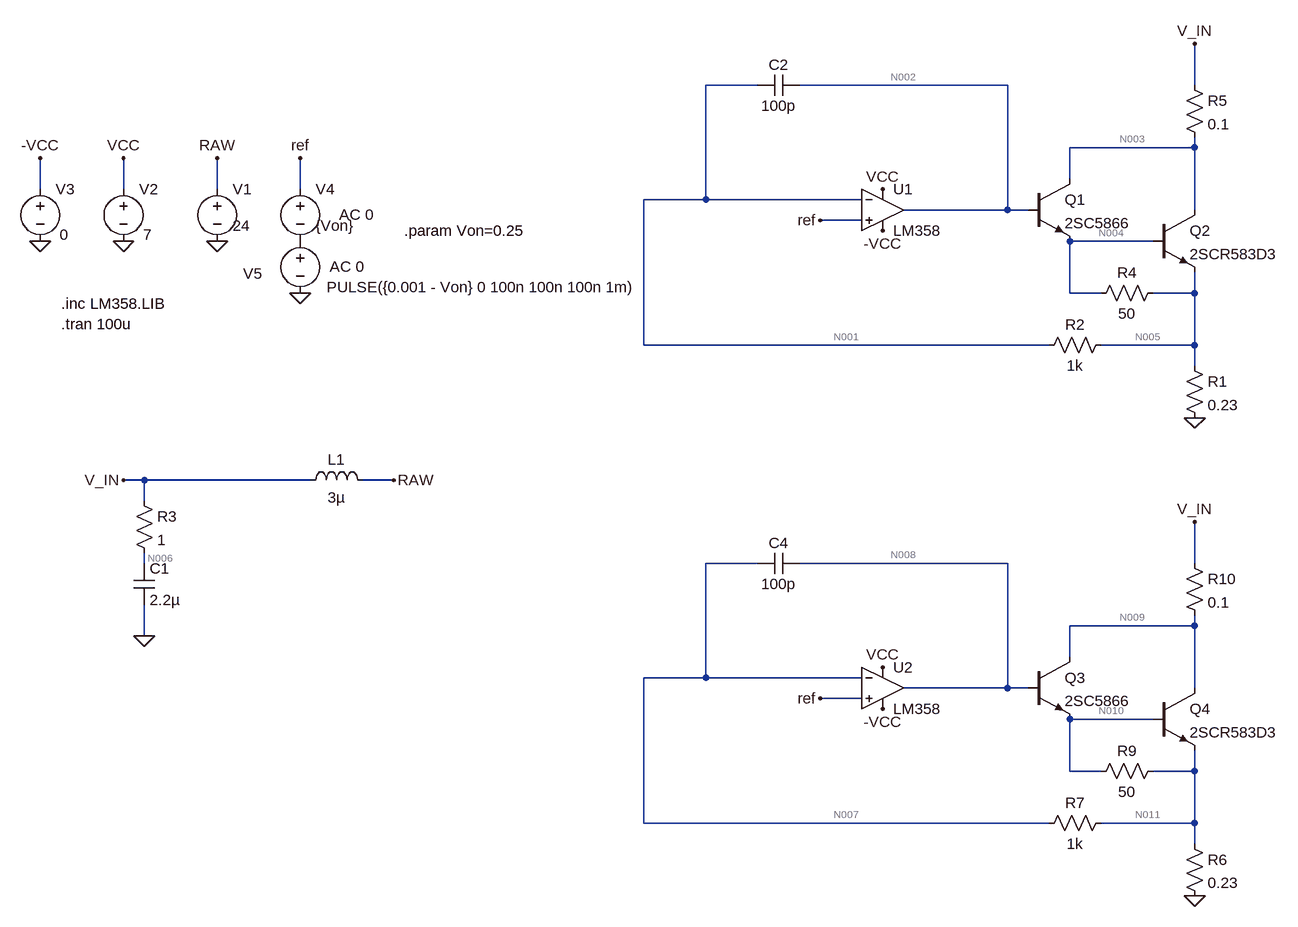
[diagram p0: schematic dual-darlington-bjt-stability-pulse.asc]
dual-darlington-bjt-stability-pulse.asc, the LTspice schematic file:
Version 4
SHEET 1 1576 1124
WIRE 0 -352 -80 -352
WIRE 384 -352 64 -352
WIRE 672 -352 672 -416
WIRE 672 -256 672 -272
WIRE 672 -256 480 -256
WIRE 480 -208 480 -256
WIRE -1104 -192 -1104 -240
WIRE -976 -192 -976 -240
WIRE -832 -192 -832 -240
WIRE -704 -192 -704 -240
WIRE -80 -176 -80 -352
WIRE -80 -176 -176 -176
WIRE 160 -176 -80 -176
WIRE 384 -160 384 -352
WIRE 384 -160 224 -160
WIRE 416 -160 384 -160
WIRE 672 -160 672 -256
WIRE 160 -144 96 -144
WIRE 608 -112 480 -112
WIRE 480 -32 480 -112
WIRE 528 -32 480 -32
WIRE 672 -32 672 -64
WIRE 672 -32 608 -32
WIRE -176 48 -176 -176
WIRE 448 48 -176 48
WIRE 672 48 672 -32
WIRE 672 48 528 48
WIRE 672 80 672 48
WIRE -944 256 -976 256
WIRE -688 256 -944 256
WIRE -560 256 -608 256
WIRE -944 288 -944 256
WIRE -944 384 -944 368
WIRE 0 384 -80 384
WIRE 384 384 64 384
WIRE 672 384 672 320
WIRE 672 480 672 464
WIRE 672 480 480 480
WIRE -944 496 -944 448
WIRE 480 528 480 480
WIRE -80 560 -80 384
WIRE -80 560 -176 560
WIRE 160 560 -80 560
WIRE 384 576 384 384
WIRE 384 576 224 576
WIRE 416 576 384 576
WIRE 672 576 672 480
WIRE 160 592 96 592
WIRE 608 624 480 624
WIRE 480 704 480 624
WIRE 528 704 480 704
WIRE 672 704 672 672
WIRE 672 704 608 704
WIRE -176 784 -176 560
WIRE 448 784 -176 784
WIRE 672 784 672 704
WIRE 672 784 528 784
WIRE 672 816 672 784
FLAG -832 -112 0
FLAG -832 -240 RAW
FLAG 192 -192 VCC
FLAG -976 -112 0
FLAG -976 -240 VCC
FLAG 672 160 0
FLAG -560 256 RAW
FLAG -1104 -112 0
FLAG -1104 -240 -VCC
FLAG 192 -128 -VCC
FLAG -704 -32 0
FLAG -704 -240 ref
FLAG 96 -144 ref
FLAG -944 496 0
FLAG -976 256 V_IN
FLAG 672 -416 V_IN
FLAG 192 544 VCC
FLAG 672 896 0
FLAG 192 608 -VCC
FLAG 96 592 ref
FLAG 672 320 V_IN
SYMBOL voltage -832 -208 R0
WINDOW 123 24 44 Left 2
WINDOW 39 0 0 Left 0
WINDOW 3 24 72 Left 2
SYMATTR Value 24
SYMATTR InstName V1
SYMBOL voltage -976 -208 R0
WINDOW 123 24 44 Left 2
WINDOW 39 0 0 Left 0
WINDOW 3 30 86 Left 2
SYMATTR Value 7
SYMATTR InstName V2
SYMBOL res 656 64 R0
SYMATTR InstName R1
SYMATTR Value 0.23
SYMBOL voltage -1104 -208 R0
WINDOW 123 24 44 Left 2
WINDOW 39 0 0 Left 0
WINDOW 3 30 86 Left 2
SYMATTR Value 0
SYMATTR InstName V3
SYMBOL voltage -704 -208 R0
WINDOW 123 60 55 Left 2
WINDOW 39 0 0 Left 0
WINDOW 3 24 72 Left 2
SYMATTR Value2 AC 0
SYMATTR Value {Von}
SYMATTR InstName V4
SYMBOL ind -704 272 R270
WINDOW 0 32 56 VTop 2
WINDOW 3 5 56 VBottom 2
SYMATTR InstName L1
SYMATTR Value 3µ
SYMBOL OpAmps\\opamp2 192 -224 R0
SYMATTR InstName U1
SYMATTR Value LM358
SYMBOL res 544 32 R90
WINDOW 0 0 56 VBottom 2
WINDOW 3 32 56 VTop 2
SYMATTR InstName R2
SYMATTR Value 1k
SYMBOL voltage -704 -128 R0
WINDOW 123 45 55 Left 2
WINDOW 39 0 0 Left 0
WINDOW 3 41 87 Left 2
WINDOW 0 -88 66 Left 2
SYMATTR Value2 AC 0
SYMATTR Value PULSE({0.001 - Von} 0 100n 100n 100n 1m)
SYMATTR InstName V5
SYMBOL cap -960 384 R0
SYMATTR InstName C1
SYMATTR Value 2.2µ
SYMBOL res -960 272 R0
SYMATTR InstName R3
SYMATTR Value 1
SYMBOL cap 64 -368 R90
WINDOW 0 0 32 VBottom 2
WINDOW 3 32 32 VTop 2
SYMATTR InstName C2
SYMATTR Value 100p
SYMBOL res 624 -48 R90
WINDOW 0 0 56 VBottom 2
WINDOW 3 32 56 VTop 2
SYMATTR InstName R4
SYMATTR Value 50
SYMBOL npn 416 -208 R0
SYMATTR InstName Q1
SYMATTR Value 2SC5866
SYMBOL npn 608 -160 R0
SYMATTR InstName Q2
SYMATTR Value 2SCR583D3
SYMBOL res 656 -368 R0
SYMATTR InstName R5
SYMATTR Value 0.1
SYMBOL res 656 800 R0
SYMATTR InstName R6
SYMATTR Value 0.23
SYMBOL OpAmps\\opamp2 192 512 R0
SYMATTR InstName U2
SYMATTR Value LM358
SYMBOL res 544 768 R90
WINDOW 0 0 56 VBottom 2
WINDOW 3 32 56 VTop 2
SYMATTR InstName R7
SYMATTR Value 1k
SYMBOL cap 64 368 R90
WINDOW 0 0 32 VBottom 2
WINDOW 3 32 32 VTop 2
SYMATTR InstName C4
SYMATTR Value 100p
SYMBOL res 624 688 R90
WINDOW 0 0 56 VBottom 2
WINDOW 3 32 56 VTop 2
SYMATTR InstName R9
SYMATTR Value 50
SYMBOL npn 416 528 R0
SYMATTR InstName Q3
SYMATTR Value 2SC5866
SYMBOL npn 608 576 R0
SYMATTR InstName Q4
SYMATTR Value 2SCR583D3
SYMBOL res 656 368 R0
SYMATTR InstName R10
SYMATTR Value 0.1
TEXT -544 -128 Left 2 !.param Von=0.25
TEXT -1072 -16 Left 2 !.inc LM358.LIB
TEXT -1072 16 Left 2 !.tran 100u

The netlist it stands for:
* dual-darlington-bjt-stability-pulse.asc
V1 RAW 0 24
V2 VCC 0 7
R1 N005 0 0.23
V3 -VCC 0 0
V4 ref P001 {Von} AC 0
L1 V_IN RAW 3µ
XU1 ref N001 VCC -VCC N002 LM358  ; pins In+ In- V+ V- OUT
R2 N005 N001 1k
V5 P001 0 PULSE({0.001 - Von} 0 100n 100n 100n 1m) AC 0
C1 N006 0 2.2µ
R3 V_IN N006 1
C2 N002 N001 100p
R4 N005 N004 50
Q1 N003 N002 N004 0 2SC5866
Q2 N003 N004 N005 0 2SCR583D3
R5 V_IN N003 0.1
R6 N011 0 0.23
XU2 ref N007 VCC -VCC N008 LM358  ; pins In+ In- V+ V- OUT
R7 N011 N007 1k
C4 N008 N007 100p
R9 N011 N010 50
Q3 N009 N008 N010 0 2SC5866
Q4 N009 N010 N011 0 2SCR583D3
R10 V_IN N009 0.1
.model NPN NPN
.model PNP PNP
.lib standard.bjt
.param Von=0.25
.inc LM358.LIB
.tran 100u
.backanno
.end

* Results of the author's LTspice run, read from the files saved beside the schematic
* Operating Point, zero values left out:
*   V(raw) = 24 V
*   V(vcc) = 7 V
*   V(n005) = 1.185 mV
*   V(ref) = 1 mV
*   V(p001) = -249 mV
*   V(v_in) = 24 V
*   V(n002) = 866.2 mV
*   V(n001) = 1.195 mV
*   V(n006) = 24 V
*   V(n004) = 258.9 mV
*   V(n003) = 24 V
*   V(n011) = 1.185 mV
*   V(n008) = 866.2 mV
*   V(n007) = 1.195 mV
*   V(n010) = 258.9 mV
*   V(n009) = 24 V
*   Ic(Q1) = 5.133 mA
*   Ib(Q1) = 20.18 µA
*   Ie(Q1) = -5.154 mA
*   Ic(Q3) = 5.133 mA
*   Ib(Q3) = 20.18 µA
*   Ie(Q3) = -5.154 mA
*   Ic(Q2) = 47.92 nA
*   Ib(Q2) = 1.012 nA
*   Ie(Q2) = -48.93 nA
*   Ic(Q4) = 47.92 nA
*   Ib(Q4) = 1.012 nA
*   Ie(Q4) = -48.93 nA
*   I(L1) = -10.27 mA
*   I(R1) = 5.154 mA
*   I(R2) = -9.503 nA
*   I(R4) = -5.154 mA
*   I(R5) = 5.134 mA
*   I(R6) = 5.154 mA
*   I(R7) = -9.503 nA
*   I(R9) = -5.154 mA
*   I(R10) = 5.134 mA
*   I(V1) = -10.27 mA
*   I(V2) = -640.4 µA
*   I(V3) = 600 µA
*   I(V4) = 20.01 nA
*   I(V5) = 20.01 nA
*   Ix(u1:IN+) = -10 nA
*   Ix(u1:IN-) = -9.503 nA
*   Ix(u1:VCC) = 320.2 µA
*   Ix(u1:VEE) = -300 µA
*   Ix(u1:OUT) = -20.18 µA
*   Ix(u2:IN+) = -10 nA
*   Ix(u2:IN-) = -9.503 nA
*   Ix(u2:VCC) = 320.2 µA
*   Ix(u2:VEE) = -300 µA
*   Ix(u2:OUT) = -20.18 µA
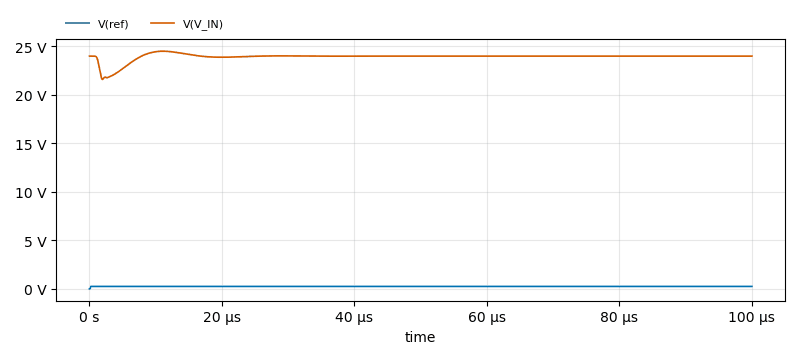
[diagram p1: Transient Analysis of dual-darlington-bjt-stability-pulse.asc, plotted from the saved traces]
* Transient Analysis, 1 run:
*   V(ref): min 1 mV, max 250 mV, average 249.6 mV, rms 249.8 mV, last 250 mV
*   V(V_IN): min 21.59 V, max 24.5 V, average 23.93 V, rms 23.94 V, last 24 V